# Altium project L1221 TOP V2.3.PrjPcb
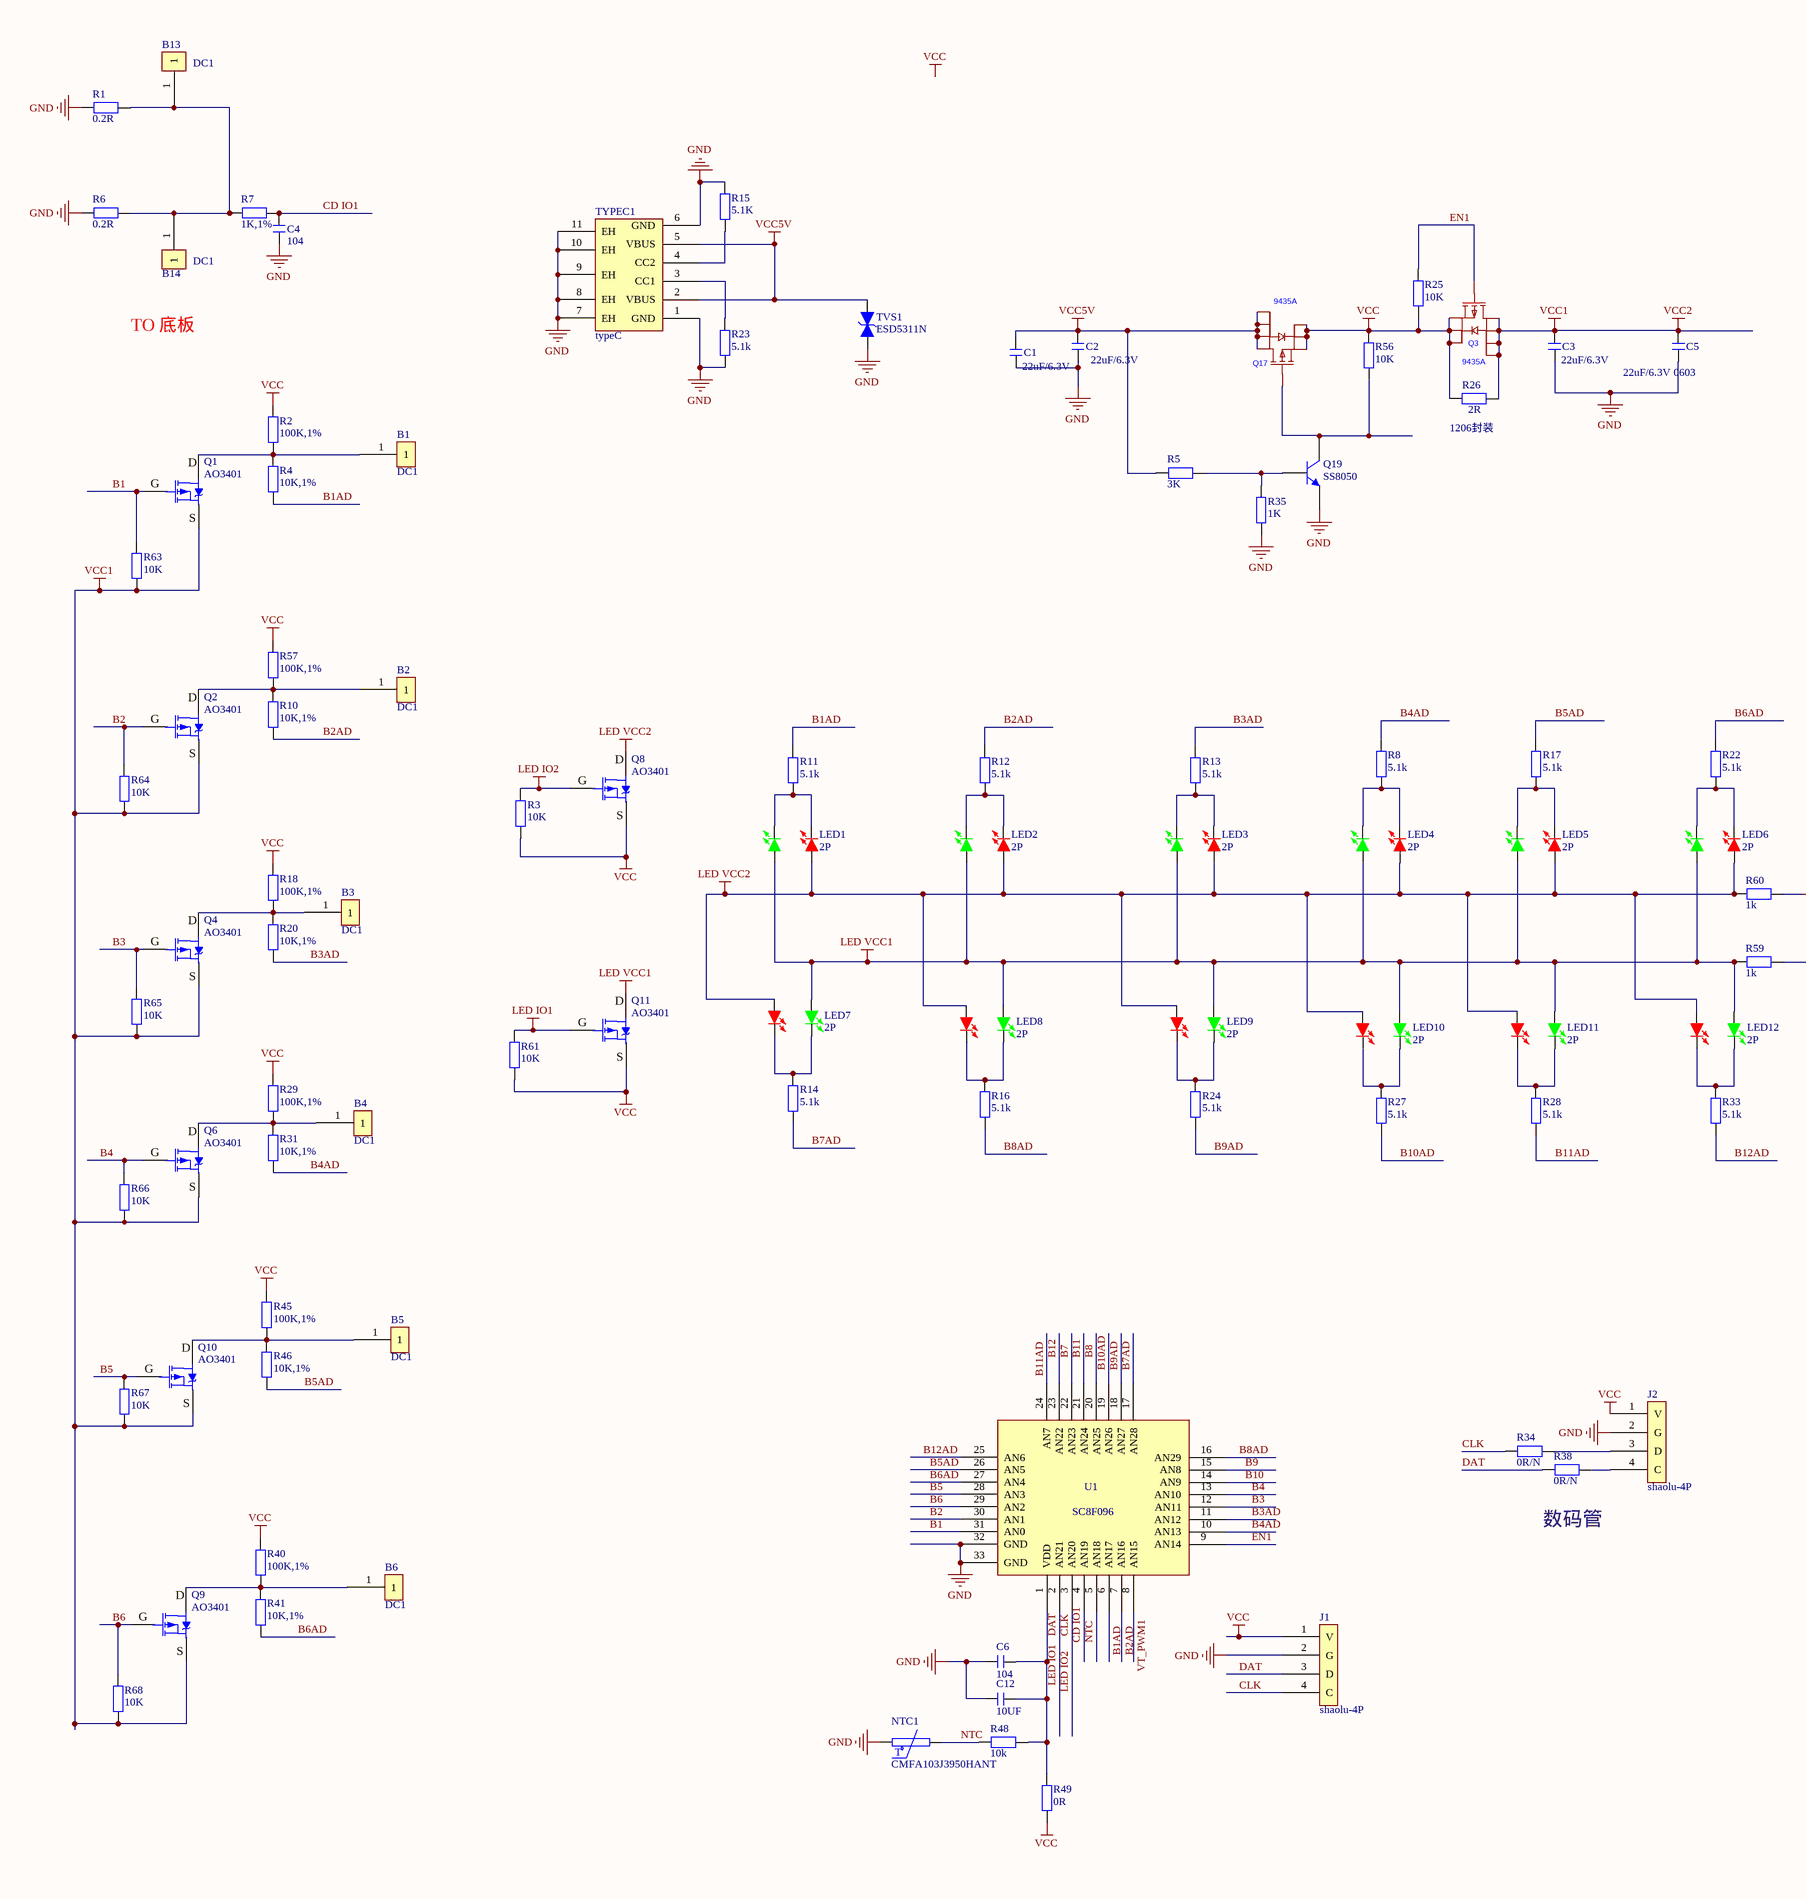
[diagram p0: L1221 TOP V2.3.SchDoc, left]
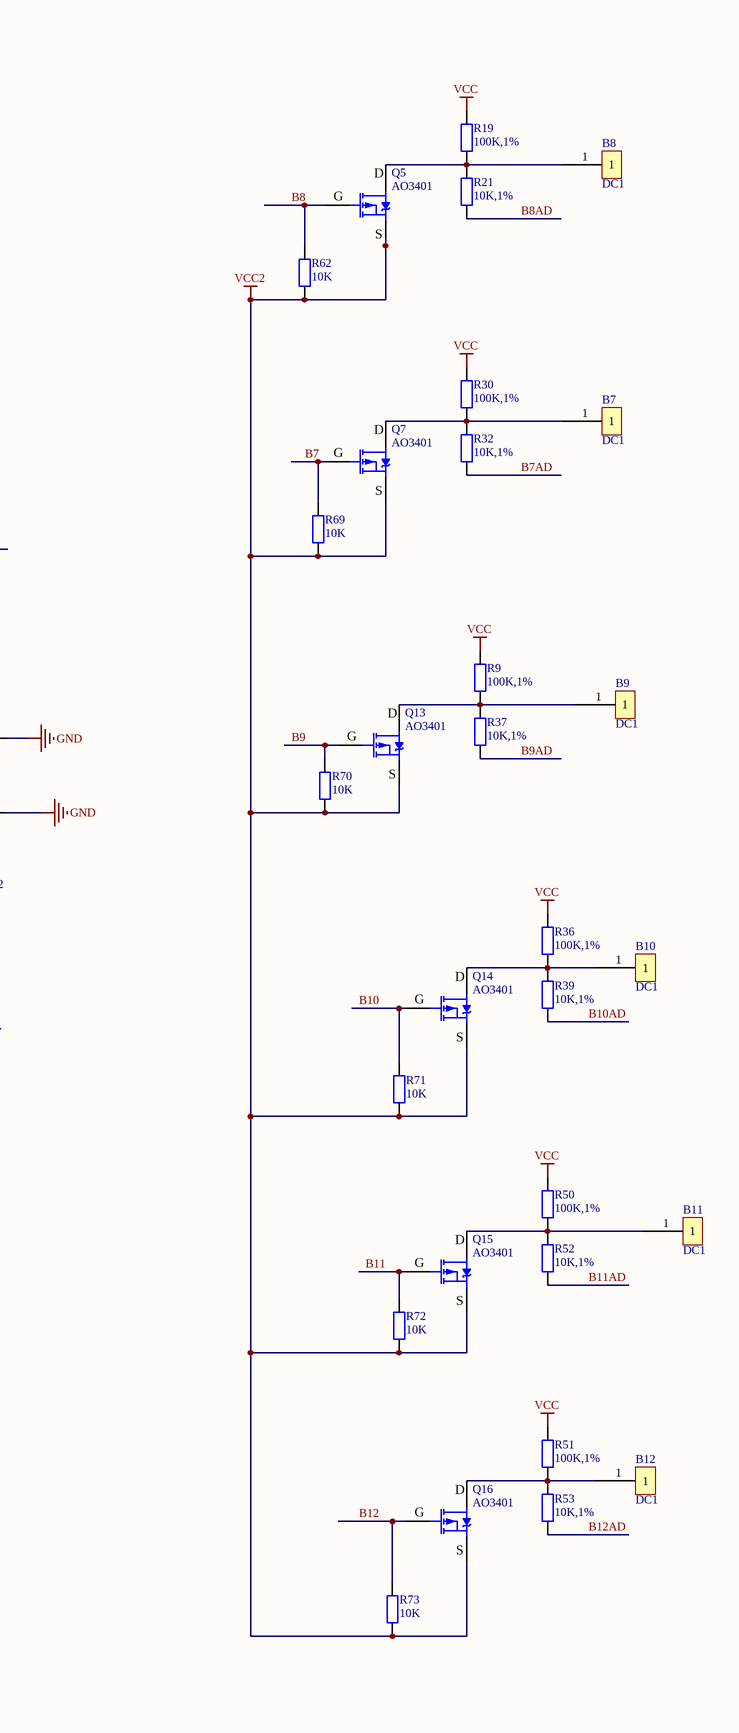
[diagram p1: L1221 TOP V2.3.SchDoc, right]
1 sheet, 122 parts. Net scope: global (net labels, ports and power ports of the same name join across sheets).
Board file: L1221 TOP V2.3.PcbDoc

## Sheet L1221 TOP V2.3.SchDoc
size A2; PageSetup: Record=PageOptions|CenterHorizontal=True|CenterVertical=True|PrintScale=1.00|XCorrection=1.00|YCorrection=1.00|PrintKind=1|BorderSize=5000000|LeftOffset=0|BottomOffset=0|Orientation=2|PaperLength=1000|PaperWidth=1000|Scale=100|PaperSource=7|PrintQuality=-3|MediaType=1|DitherType=10|PrintScaleMode=1|PaperKind=A5|PaperIndex=11

### Parts
B1  DC1  [POPOPIN01]
B2  DC1  [POPOPIN01]
B3  DC1  [POPOPIN01]
B4  DC1  [POPOPIN01]
B5  DC1  [POPOPIN01]
B6  DC1  [POPOPIN01]
B7  DC1  [POPOPIN01]
B8  DC1  [POPOPIN01]
B9  DC1  [POPOPIN01]
B10  DC1  [POPOPIN01]
B11  DC1  [POPOPIN01]
B12  DC1  [POPOPIN01]
B13  DC1  [POPOPIN01]
B14  DC1  [POPOPIN01]
C1  22uF/6.3V  [0805L]
C2  22uF/6.3V  [0805l]
C3  22uF/6.3V  [0805l]
C4  104  [R0402]
C5  22uF/6.3V 0603  [0805l]
C6  104  [R0402]
C12  10UF  [0603L]
J1  shaolu-4P  [shaolu-4P]
J2  shaolu-4P  [W60.5-L48数码管]
LED1  2P  [LED 0606]
LED2  2P  [LED 0606]
LED3  2P  [LED 0606]
LED4  2P  [LED 0606]
LED5  2P  [LED 0606]
LED6  2P  [LED 0606]
LED7  2P  [LED 0606]
LED8  2P  [LED 0606]
LED9  2P  [LED 0606]
LED10  2P  [LED 0606]
LED11  2P  [LED 0606]
LED12  2P  [LED 0606]
NTC1  CMFA103J3950HANT  [0603L]
Q1  AO3401  [SOT23-3N]
Q2  AO3401  [SOT23-3N]
Q3  9435A  [SOP8]
Q4  AO3401  [SOT23-3N]
Q5  AO3401  [SOT23-3N]
Q6  AO3401  [SOT23-3N]
Q7  AO3401  [SOT23-3N]
Q8  AO3401  [SOT23-3N]
Q9  AO3401  [SOT23-3N]
Q10  AO3401  [SOT23-3N]
Q11  AO3401  [SOT23-3N]
Q13  AO3401  [SOT23-3N]
Q14  AO3401  [SOT23-3N]
Q15  AO3401  [SOT23-3N]
Q16  AO3401  [SOT23-3N]
Q17  9435A  [SOP8]
Q19  SS8050  [SOT23-3N]
R1  0.2R  [R 1206_L]
R2  100K,1%  [R0402]
R3  10K  [R0402]
R4  10K,1%  [R0402]
R5  3K  [R0402]
R6  0.2R  [R 1206_L]
R7  1K,1%  [R0402]
R8  5.1k  [R0402]
R9  100K,1%  [R0402]
R10  10K,1%  [R0402]
R11  5.1k  [R0402]
R12  5.1k  [R0402]
R13  5.1k  [R0402]
R14  5.1k  [R0402]
R15  5.1K  [r0402]
R16  5.1k  [R0402]
R17  5.1k  [R0402]
R18  100K,1%  [R0402]
R19  100K,1%  [R0402]
R20  10K,1%  [R0402]
R21  10K,1%  [R0402]
R22  5.1k  [R0402]
R23  5.1k  [R0402]
R24  5.1k  [R0402]
R25  10K  [R0402]
R26  2R  [R 1206_L]
R27  5.1k  [R0402]
R28  5.1k  [R0402]
R29  100K,1%  [R0402]
R30  100K,1%  [R0402]
R31  10K,1%  [R0402]
R32  10K,1%  [R0402]
R33  5.1k  [R0402]
R34  0R/N  [R0402]
R35  1K  [R0402]
R36  100K,1%  [R0402]
R37  10K,1%  [R0402]
R38  0R/N  [R0402]
R39  10K,1%  [R0402]
R40  100K,1%  [R0402]
R41  10K,1%  [R0402]
R45  100K,1%  [R0402]
R46  10K,1%  [R0402]
R48  10k  [R0402]
R49  0R  [R0402]
R50  100K,1%  [R0402]
R51  100K,1%  [R0402]
R52  10K,1%  [R0402]
R53  10K,1%  [R0402]
R56  10K  [R0402]
R57  100K,1%  [R0402]
R59  1k  [R0402]
R60  1k  [R0402]
R61  10K  [R0402]
R62  10K  [R0402]
R63  10K  [R0402]
R64  10K  [R0402]
R65  10K  [R0402]
R66  10K  [R0402]
R67  10K  [R0402]
R68  10K  [R0402]
R69  10K  [R0402]
R70  10K  [R0402]
R71  10K  [R0402]
R72  10K  [R0402]
R73  10K  [R0402]
TVS1  ESD5311N  [DFN1006-2L]
TYPEC1  typeC  [typeC]
U1  SC8F096  [QFN-32-4*4]

### Nets
CLK: J1.4(C) Q8.1(G) R3.2 R34.2 U1.3(AN20)  [also labelled LED IO2]
DAT: J1.3(D) Q11.1(G) R38.2 R61.2 U1.2(AN21)  [also labelled LED IO1]
GND: C1.1 C2.1 C3.1 C4.1 C5.1 C6.1 C12.1 J1.2(G) J2.2(G) NTC1.1 Q19.2(E) R1.1 R6.1 R15.2 R23.1 R35.1 R59.1 R60.2 TVS1.1(A) TYPEC1.1(GND) TYPEC1.6(GND) TYPEC1.7(EH) TYPEC1.8(EH) TYPEC1.9(EH) TYPEC1.10(EH) TYPEC1.11(EH) U1.32(GND) U1.33(GND)
LED VCC1: LED1.3 LED2.3 LED3.3 LED4.3 LED5.3 LED6.3 LED7.3 LED8.3 LED9.3 LED10.3 LED11.3 LED12.3 Q11.3(D) R59.2
LED VCC2: LED1.1 LED2.1 LED3.1 LED4.1 LED5.1 LED6.1 LED7.1 LED8.1 LED9.1 LED10.1 LED11.1 LED12.1 Q8.3(D) R60.1
VCC: J1.1(V) J2.1(V) Q3.1(S) Q3.2(S) Q3.3(S) Q8.2(S) Q11.2(S) Q17.1(S) Q17.2(S) Q17.3(S) R2.2 R3.1 R9.2 R18.2 R19.2 R25.1 R26.2 R29.2 R30.2 R36.2 R40.2 R45.2 R49.2 R50.2 R51.2 R56.2 R57.2 R61.1
VCC1: C3.2 C5.2 Q1.2(S) Q2.2(S) Q3.5(D) Q3.6(D) Q3.7(D) Q3.8(D) Q4.2(S) Q5.2(S) Q6.2(S) Q7.2(S) Q9.2(S) Q10.2(S) Q13.2(S) Q14.2(S) Q15.2(S) Q16.2(S) R26.1 R62.1 R63.1 R64.1 R65.1 R66.1 R67.1 R68.1 R69.1 R70.1 R71.1 R72.1 R73.1  [also labelled VCC2]
VCC5V: C1.2 C2.2 Q17.5(D) Q17.6(D) Q17.7(D) Q17.8(D) R5.1 TVS1.2(K) TYPEC1.2(VBUS) TYPEC1.5(VBUS)
B1: Q1.1(G) R63.2 U1.31(AN0)
B1AD: R4.1 R11.2 U1.6(AN17)
B2: Q2.1(G) R64.2 U1.30(AN1)
B2AD: R10.1 R12.2 U1.7(AN16)
B3: Q4.1(G) R65.2 U1.12(AN11)
B3AD: R13.2 R20.1 U1.11(AN12)
B4: Q6.1(G) R66.2 U1.13(AN10)
B4AD: R8.2 R31.1 U1.10(AN13)
B5: Q10.1(G) R67.2 U1.28(AN3)
B5AD: R17.2 R46.1 U1.26(AN5)
B6: Q9.1(G) R68.2 U1.29(AN2)
B6AD: R22.2 R41.1 U1.27(AN4)
B7: Q7.1(G) R69.2 U1.22(AN23)
B7AD: R14.1 R32.1 U1.17(AN28)
B8: Q5.1(G) R62.2 U1.20(AN25)
B8AD: R16.1 R21.1 U1.16(AN29)
B9: Q13.1(G) R70.2 U1.15(AN8)
B9AD: R24.1 R37.1 U1.18(AN27)
B10: Q14.1(G) R71.2 U1.14(AN9)
B10AD: R27.1 R39.1 U1.19(AN26)
B11: Q15.1(G) R72.2 U1.21(AN24)
B11AD: R28.1 R52.1 U1.24(AN7)
B12: Q16.1(G) R73.2 U1.23(AN22)
B12AD: R33.1 R53.1 U1.25(AN6)
CD IO1: C4.2 R7.2 U1.4(AN19)
EN1: Q3.4(G) R25.2 U1.9(AN14)
NTC: NTC1.2 R48.2 U1.5(AN18)
VT_PWM1: U1.8(AN15)
NetB1_1: B1.1 Q1.3(D) R2.1 R4.2
NetB2_1: B2.1 Q2.3(D) R10.2 R57.1
NetB3_1: B3.1 Q4.3(D) R18.1 R20.2
NetB4_1: B4.1 Q6.3(D) R29.1 R31.2
NetB5_1: B5.1 Q10.3(D) R45.1 R46.2
NetB6_1: B6.1 Q9.3(D) R40.1 R41.2
NetB7_1: B7.1 Q7.3(D) R30.1 R32.2
NetB8_1: B8.1 Q5.3(D) R19.1 R21.2
NetB9_1: B9.1 Q13.3(D) R9.1 R37.2
NetB10_1: B10.1 Q14.3(D) R36.1 R39.2
NetB11_1: B11.1 Q15.3(D) R50.1 R52.2
NetB12_1: B12.1 Q16.3(D) R51.1 R53.2
NetB13_1: B13.1 B14.1 R1.2 R6.2 R7.1
NetC6_2: C6.2 C12.2 R48.1 R49.1 U1.1(VDD)
NetJ2_3: J2.3(D) R34.1
NetJ2_4: J2.4(C) R38.1
NetLED1_2: LED1.2 LED1.4 R11.1
NetLED2_2: LED2.2 LED2.4 R12.1
NetLED3_2: LED3.2 LED3.4 R13.1
NetLED4_2: LED4.2 LED4.4 R8.1
NetLED5_2: LED5.2 LED5.4 R17.1
NetLED6_2: LED6.2 LED6.4 R22.1
NetLED7_2: LED7.2 LED7.4 R14.2
NetLED8_2: LED8.2 LED8.4 R16.2
NetLED9_2: LED9.2 LED9.4 R24.2
NetLED10_2: LED10.2 LED10.4 R27.2
NetLED11_2: LED11.2 LED11.4 R28.2
NetLED12_2: LED12.2 LED12.4 R33.2
NetQ17_4: Q17.4(G) Q19.3(C) R56.1
NetQ19_1: Q19.1(B) R5.2 R35.2
NetR15_1: R15.1 TYPEC1.4(CC2)
NetR23_2: R23.2 TYPEC1.3(CC1)

### Notes on the sheet
- TO 底板
- (near R26) 1206封装
- 数码管
- Labels drawn without touching a wire or pin: VCC
- (in symbol RES2-R) T

### Library data of the parts
B1-B14 = dianchi1
C1-C6 C12 = C: 无极性贴片电容; 版权归属: 源创客; BOM名称: 无极性贴片电容; 学习资源: www.ooocke.com
LED1-LED12 = LED RG-K: 共阴双色LED; 版权归属: 源创客; BOM名称: 共阴双色LED; 学习资源: www.ooocke.com
NTC1 = RES2-R
Q1 Q2 Q4-Q11 Q13-Q16 = SI2301: P沟道场效应管; 版权归属: 源创客; BOM名称: P沟道场效应管; 学习资源: www.ooocke.com
Q3 Q17 = 9435A: Manufacturer: HL(富海微); Add into BOM: yes; Type: 1个P沟道; Drain Source Voltage (Vdss): 30V; Continuous Drain Current (Id): 5.3A; Drain Source On Resistance (RDS(on)@Vgs,Id): 36mΩ; Gate Threshold Voltage (Vgs(th)@Id): 2.5V; Symbol: 9435A; Device: 9435A; LCSC Part Name: 1个P沟道 耐压:30V 电流:5.3A; Supplier Part: C18164390; Manufacturer Part: 9435A; Supplier Footprint: SOP-8; JLCPCB Part Class: Extended Part; Datasheet: https://atta.szlcsc.com/upload/public/pdf/source/20231012/77E84B3893B68DEDAD6134B200AA9774.pdf; Supplier: LCSC; Convert to PCB: yes
Q19 = QNPN: NPN Bipolar Transistor; Published: 8-Jun-2000; LatestRevisionDate: 29-May-2009; LatestRevisionNote: IPC-7351 Footprint Added.; PackageVersion: Aug-1999; PackageReference: SOT-23B; Publisher: Altium Limited; PackageDescription: 3-Pin SOT-23 Package 0.95 mm Pitch, 2.4 mm Lead Span
R1 R5-R7 R15 R23 R34 R35 R38 = R: 贴片电阻; 版权归属: 源创客; BOM名称: 贴片电阻; 学习资源: www.ooocke.com
R2 R3 R18 R48 R49 R57 R59-R61 = R: 贴片电阻; 版权归属: 源创客; Tolerance: ±5%; BOM名称: 贴片电阻; 学习资源: www.ooocke.com
  R3 R18 R48 R49 R57 R59-R61: Tolerance: Tolerance
R4 R10 R20 R21 R31 R32 R37 R39 R41 R46 R52 R53 = R: 贴片电阻; BOM名称: 贴片电阻; Tolerance: ±1%
R8 R11-R14 R16 R17 R22 R24 R27 R28 R33 = R: 贴片电阻; 版权归属: 源创客; Tolerance: ±5%; ±5%: Tolerance; BOM名称: 贴片电阻; 学习资源: www.ooocke.com; Tolerance: Tolerance
R9 R19 R25 R26 R30 R40 R45 R50 R56 R62-R73 = R: 贴片电阻; 版权归属: 源创客; ±5%: Tolerance; Tolerance: ±5%; BOM名称: 贴片电阻; 学习资源: www.ooocke.com
R29 R36 R51 = R: 贴片电阻; Tolerance: ±5%; BOM名称: 贴片电阻
TVS1 = DIODE-3
U1 = SC8F096AD832NPR